# EAGLE design ComputerLED_Display (EAGLE 4.16)
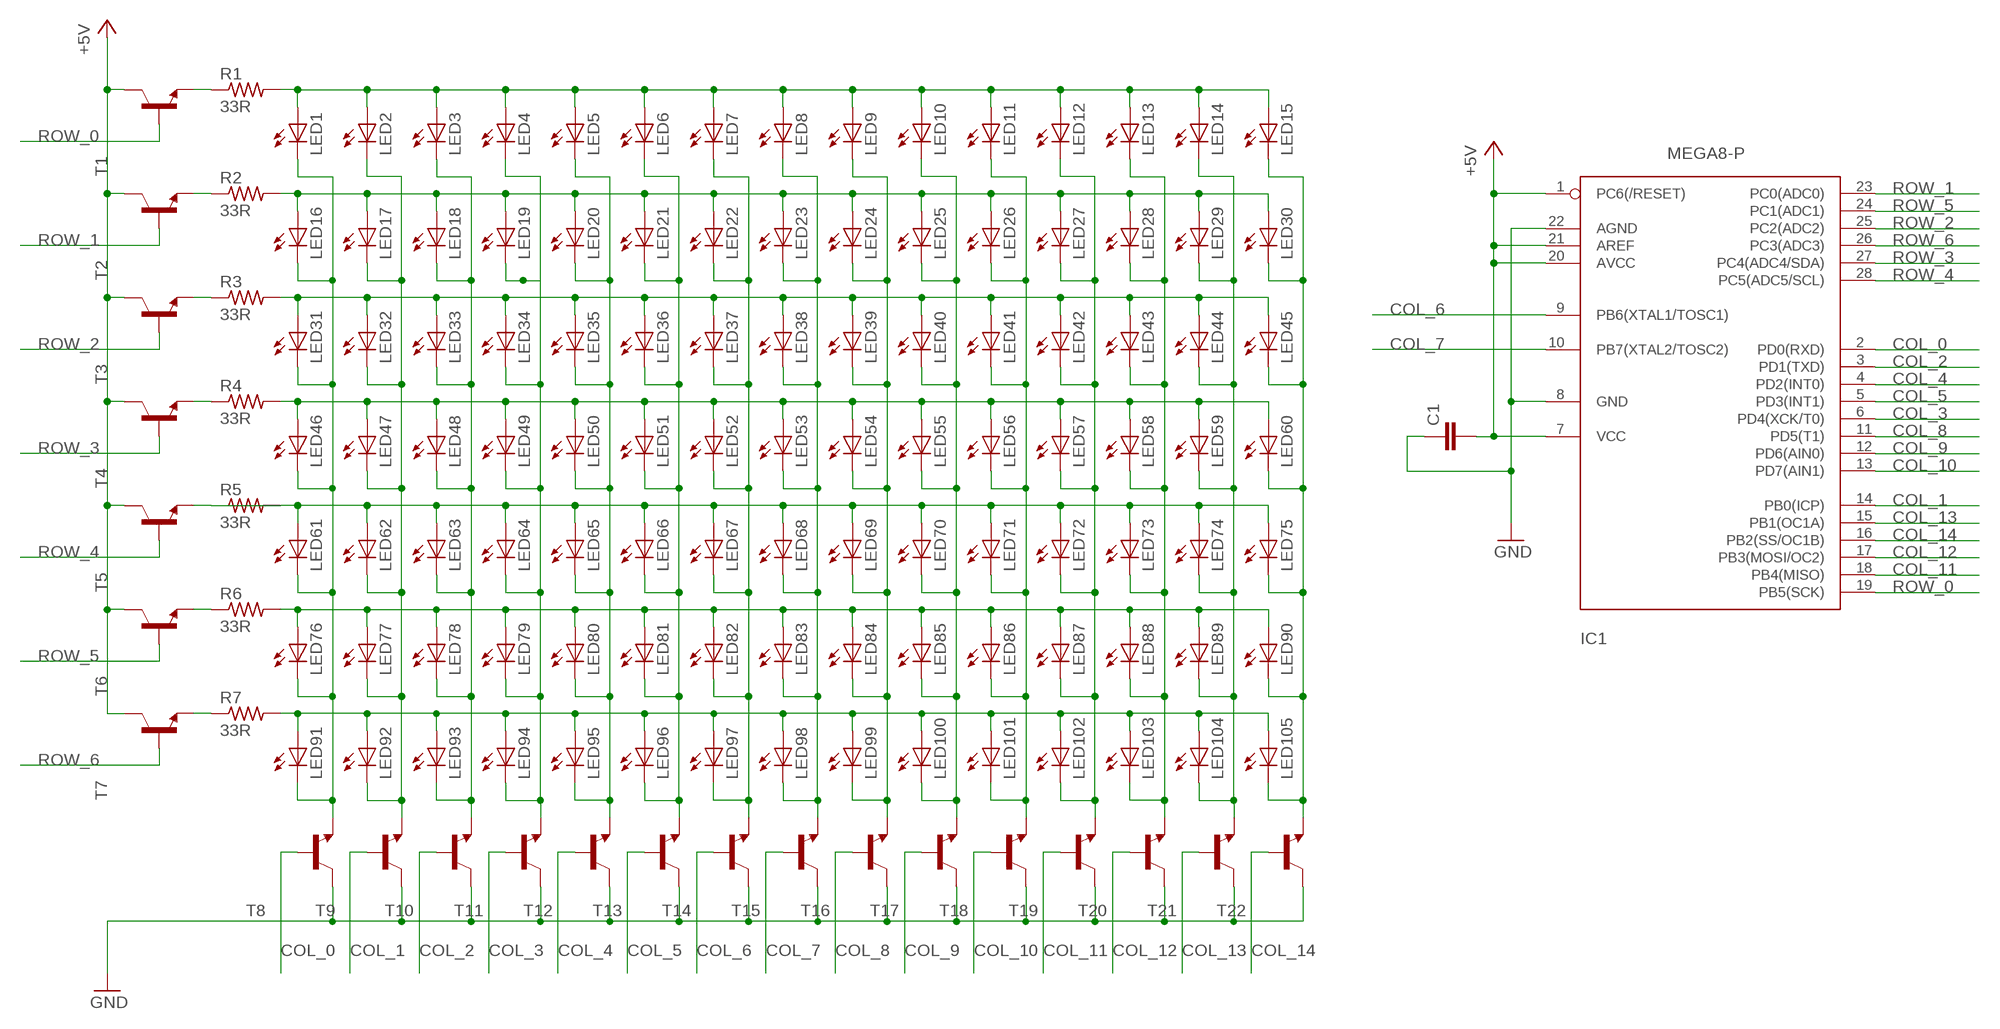
[diagram p0: schematic, sheet 1]

## Parts
C1  C-EU025-024X044  [C025-024X044]
IC1  MEGA8-P  [DIL28-3]
LED1  LED3MM  [LED3MM]
LED2  LED3MM  [LED3MM]
LED3  LED3MM  [LED3MM]
LED4  LED3MM  [LED3MM]
LED5  LED3MM  [LED3MM]
LED6  LED3MM  [LED3MM]
LED7  LED3MM  [LED3MM]
LED8  LED3MM  [LED3MM]
LED9  LED3MM  [LED3MM]
LED10  LED3MM  [LED3MM]
LED11  LED3MM  [LED3MM]
LED12  LED3MM  [LED3MM]
LED13  LED3MM  [LED3MM]
LED14  LED3MM  [LED3MM]
LED15  LED3MM  [LED3MM]
LED16  LED3MM  [LED3MM]
LED17  LED3MM  [LED3MM]
LED18  LED3MM  [LED3MM]
LED19  LED3MM  [LED3MM]
LED20  LED3MM  [LED3MM]
LED21  LED3MM  [LED3MM]
LED22  LED3MM  [LED3MM]
LED23  LED3MM  [LED3MM]
LED24  LED3MM  [LED3MM]
LED25  LED3MM  [LED3MM]
LED26  LED3MM  [LED3MM]
LED27  LED3MM  [LED3MM]
LED28  LED3MM  [LED3MM]
LED29  LED3MM  [LED3MM]
LED30  LED3MM  [LED3MM]
LED31  LED3MM  [LED3MM]
LED32  LED3MM  [LED3MM]
LED33  LED3MM  [LED3MM]
LED34  LED3MM  [LED3MM]
LED35  LED3MM  [LED3MM]
LED36  LED3MM  [LED3MM]
LED37  LED3MM  [LED3MM]
LED38  LED3MM  [LED3MM]
LED39  LED3MM  [LED3MM]
LED40  LED3MM  [LED3MM]
LED41  LED3MM  [LED3MM]
LED42  LED3MM  [LED3MM]
LED43  LED3MM  [LED3MM]
LED44  LED3MM  [LED3MM]
LED45  LED3MM  [LED3MM]
LED46  LED3MM  [LED3MM]
LED47  LED3MM  [LED3MM]
LED48  LED3MM  [LED3MM]
LED49  LED3MM  [LED3MM]
LED50  LED3MM  [LED3MM]
LED51  LED3MM  [LED3MM]
LED52  LED3MM  [LED3MM]
LED53  LED3MM  [LED3MM]
LED54  LED3MM  [LED3MM]
LED55  LED3MM  [LED3MM]
LED56  LED3MM  [LED3MM]
LED57  LED3MM  [LED3MM]
LED58  LED3MM  [LED3MM]
LED59  LED3MM  [LED3MM]
LED60  LED3MM  [LED3MM]
LED61  LED3MM  [LED3MM]
LED62  LED3MM  [LED3MM]
LED63  LED3MM  [LED3MM]
LED64  LED3MM  [LED3MM]
LED65  LED3MM  [LED3MM]
LED66  LED3MM  [LED3MM]
LED67  LED3MM  [LED3MM]
LED68  LED3MM  [LED3MM]
LED69  LED3MM  [LED3MM]
LED70  LED3MM  [LED3MM]
LED71  LED3MM  [LED3MM]
LED72  LED3MM  [LED3MM]
LED73  LED3MM  [LED3MM]
LED74  LED3MM  [LED3MM]
LED75  LED3MM  [LED3MM]
LED76  LED3MM  [LED3MM]
LED77  LED3MM  [LED3MM]
LED78  LED3MM  [LED3MM]
LED79  LED3MM  [LED3MM]
LED80  LED3MM  [LED3MM]
LED81  LED3MM  [LED3MM]
LED82  LED3MM  [LED3MM]
LED83  LED3MM  [LED3MM]
LED84  LED3MM  [LED3MM]
LED85  LED3MM  [LED3MM]
LED86  LED3MM  [LED3MM]
LED87  LED3MM  [LED3MM]
LED88  LED3MM  [LED3MM]
LED89  LED3MM  [LED3MM]
LED90  LED3MM  [LED3MM]
LED91  LED3MM  [LED3MM]
LED92  LED3MM  [LED3MM]
LED93  LED3MM  [LED3MM]
LED94  LED3MM  [LED3MM]
LED95  LED3MM  [LED3MM]
LED96  LED3MM  [LED3MM]
LED97  LED3MM  [LED3MM]
LED98  LED3MM  [LED3MM]
LED99  LED3MM  [LED3MM]
LED100  LED3MM  [LED3MM]
LED101  LED3MM  [LED3MM]
LED102  LED3MM  [LED3MM]
LED103  LED3MM  [LED3MM]
LED104  LED3MM  [LED3MM]
LED105  LED3MM  [LED3MM]
R1  33R  R-US_0204/5  [0204/5]
R2  33R  R-US_0204/5  [0204/5]
R3  33R  R-US_0204/5  [0204/5]
R4  33R  R-US_0204/5  [0204/5]
R5  33R  R-US_0204/5  [0204/5]
R6  33R  R-US_0204/5  [0204/5]
R7  33R  R-US_0204/5  [0204/5]
T1  BC635-NPN-TO92-BCE  [TO92-BCE]
T2  BC635-NPN-TO92-BCE  [TO92-BCE]
T3  BC635-NPN-TO92-BCE  [TO92-BCE]
T4  BC635-NPN-TO92-BCE  [TO92-BCE]
T5  BC635-NPN-TO92-BCE  [TO92-BCE]
T6  BC635-NPN-TO92-BCE  [TO92-BCE]
T7  BC635-NPN-TO92-BCE  [TO92-BCE]
T8  BC635-NPN-TO92-BCE  [TO92-BCE]
T9  BC635-NPN-TO92-BCE  [TO92-BCE]
T10  BC635-NPN-TO92-BCE  [TO92-BCE]
T11  BC635-NPN-TO92-BCE  [TO92-BCE]
T12  BC635-NPN-TO92-BCE  [TO92-BCE]
T13  BC635-NPN-TO92-BCE  [TO92-BCE]
T14  BC635-NPN-TO92-BCE  [TO92-BCE]
T15  BC635-NPN-TO92-BCE  [TO92-BCE]
T16  BC635-NPN-TO92-BCE  [TO92-BCE]
T17  BC635-NPN-TO92-BCE  [TO92-BCE]
T18  BC635-NPN-TO92-BCE  [TO92-BCE]
T19  BC635-NPN-TO92-BCE  [TO92-BCE]
T20  BC635-NPN-TO92-BCE  [TO92-BCE]
T21  BC635-NPN-TO92-BCE  [TO92-BCE]
T22  BC635-NPN-TO92-BCE  [TO92-BCE]

## Nets
+5V: C1.2 IC1.1(PC6(/RESET)) IC1.7(VCC) IC1.20(AVCC) IC1.21(AREF) T1.C T2.C T3.C T4.C T5.C T6.C T7.C
COL_0: IC1.2(PD0(RXD)) T8.B
COL_1: IC1.14(PB0(ICP)) T9.B
COL_2: IC1.3(PD1(TXD)) T10.B
COL_3: IC1.6(PD4(XCK/T0)) T11.B
COL_4: IC1.4(PD2(INT0)) T12.B
COL_5: IC1.5(PD3(INT1)) T13.B
COL_6: IC1.9(PB6(XTAL1/TOSC1)) T14.B
COL_7: IC1.10(PB7(XTAL2/TOSC2)) T15.B
COL_8: IC1.11(PD5(T1)) T16.B
COL_9: IC1.12(PD6(AIN0)) T17.B
COL_10: IC1.13(PD7(AIN1)) T18.B
COL_11: IC1.18(PB4(MISO)) T19.B
COL_12: IC1.17(PB3(MOSI/OC2)) T20.B
COL_13: IC1.15(PB1(OC1A)) T21.B
COL_14: IC1.16(PB2(SS/OC1B)) T22.B
GND: C1.1 IC1.8(GND) IC1.22(AGND) T8.C T9.C T10.C T11.C T12.C T13.C T14.C T15.C T16.C T17.C T18.C T19.C T20.C T21.C T22.C
N$1: LED16.A LED17.A LED18.A LED19.A LED20.A LED21.A LED22.A LED23.A LED24.A LED25.A LED26.A LED27.A LED28.A LED29.A LED30.A R2.2
N$2: LED1.A LED2.A LED3.A LED4.A LED5.A LED6.A LED7.A LED8.A LED9.A LED10.A LED11.A LED12.A LED13.A LED14.A LED15.A R1.2
N$3: LED31.A LED32.A LED33.A LED34.A LED35.A LED36.A LED37.A LED38.A LED39.A LED40.A LED41.A LED42.A LED43.A LED44.A LED45.A R3.2
N$4: LED46.A LED47.A LED48.A LED49.A LED50.A LED51.A LED52.A LED53.A LED54.A LED55.A LED56.A LED57.A LED58.A LED59.A LED60.A R4.2
N$5: LED61.A LED62.A LED63.A LED64.A LED65.A LED66.A LED67.A LED68.A LED69.A LED70.A LED71.A LED72.A LED73.A LED74.A LED75.A R5.2
N$6: LED76.A LED77.A LED78.A LED79.A LED80.A LED81.A LED82.A LED83.A LED84.A LED85.A LED86.A LED87.A LED88.A LED89.A LED90.A R6.2
N$7: LED91.A LED92.A LED93.A LED94.A LED95.A LED96.A LED97.A LED98.A LED99.A LED100.A LED101.A LED102.A LED103.A LED104.A LED105.A R7.2
N$8: LED1.K(C) LED16.K(C) LED31.K(C) LED46.K(C) LED61.K(C) LED76.K(C) LED91.K(C) T8.E
N$9: LED2.K(C) LED17.K(C) LED32.K(C) LED47.K(C) LED62.K(C) LED77.K(C) LED92.K(C) T9.E
N$10: LED3.K(C) LED18.K(C) LED33.K(C) LED48.K(C) LED63.K(C) LED78.K(C) LED93.K(C) T10.E
N$11: LED4.K(C) LED19.K(C) LED34.K(C) LED49.K(C) LED64.K(C) LED79.K(C) LED94.K(C) T11.E
N$12: LED5.K(C) LED20.K(C) LED35.K(C) LED50.K(C) LED65.K(C) LED80.K(C) LED95.K(C) T12.E
N$13: LED6.K(C) LED21.K(C) LED36.K(C) LED51.K(C) LED66.K(C) LED81.K(C) LED96.K(C) T13.E
N$14: LED7.K(C) LED22.K(C) LED37.K(C) LED52.K(C) LED67.K(C) LED82.K(C) LED97.K(C) T14.E
N$15: LED8.K(C) LED23.K(C) LED38.K(C) LED53.K(C) LED68.K(C) LED83.K(C) LED98.K(C) T15.E
N$16: LED9.K(C) LED24.K(C) LED39.K(C) LED54.K(C) LED69.K(C) LED84.K(C) LED99.K(C) T16.E
N$17: LED10.K(C) LED25.K(C) LED40.K(C) LED55.K(C) LED70.K(C) LED85.K(C) LED100.K(C) T17.E
N$18: LED11.K(C) LED26.K(C) LED41.K(C) LED56.K(C) LED71.K(C) LED86.K(C) LED101.K(C) T18.E
N$19: LED12.K(C) LED27.K(C) LED42.K(C) LED57.K(C) LED72.K(C) LED87.K(C) LED102.K(C) T19.E
N$20: LED13.K(C) LED28.K(C) LED43.K(C) LED58.K(C) LED73.K(C) LED88.K(C) LED103.K(C) T20.E
N$21: LED14.K(C) LED29.K(C) LED44.K(C) LED59.K(C) LED74.K(C) LED89.K(C) LED104.K(C) T21.E
N$22: LED15.K(C) LED30.K(C) LED45.K(C) LED60.K(C) LED75.K(C) LED90.K(C) LED105.K(C) T22.E
N$23: R7.1 T7.E
N$24: R6.1 T6.E
N$25: R5.1 T5.E
N$26: R4.1 T4.E
N$27: R3.1 T3.E
N$28: R2.1 T2.E
N$29: R1.1 T1.E
ROW_0: IC1.19(PB5(SCK)) T1.B
ROW_1: IC1.23(PC0(ADC0)) T2.B
ROW_2: IC1.25(PC2(ADC2)) T3.B
ROW_3: IC1.27(PC4(ADC4/SDA)) T4.B
ROW_4: IC1.28(PC5(ADC5/SCL)) T5.B
ROW_5: IC1.24(PC1(ADC1)) T6.B
ROW_6: IC1.26(PC3(ADC3)) T7.B

## Library data of the parts
C1 = rcl:C-EU: CAPACITOR, European symbol
IC1 = atmel:MEGA8-P: MICROCONTROLLER 8 Kbytes FLASH 1 kbytes SRAM 512 bytes EEPROM USART 4-channel 10 bit ADC 2-channel 8 bit ADC Source: avr.lbr
LED1-LED105 = led:LED: LED OSRAM: - CHIPLED LG R971, LG N971, LY N971, LG Q971, LY Q971, LO R971, LY R971 LH N974, LH R974 LS Q976, LO Q976, LY Q976 LO Q996 - Hyper CHIPLED LW Q18S LB Q993, LB Q99A, LB R99A - SideLED LS A670, LO A670, LY A670, LG A670, LP A670 LB A673, LV A673, LT A673, LW A673 LH A674 LY A675 LS A676, LA A676, LO A676, LY A676, LW A676 LS A679, LY A679, LG A679 - Hyper Micro SIDELED® LS Y876, LA Y876, LO Y876, LY Y876 LT Y87S - SmartLED LW L88C, LW L88S LB L89C, LB L89S, LG L890 LS L89K, LO L89K, LY L89K LS L896, LA L896, LO L896, LY L896 - TOPLED LS T670, LO T670, LY T670, LG T670, LP T670 LSG T670, LSP T670, LSY T670, LOP T670, LYG T670 LG T671, LOG T671, LSG T671 LB T673, LV T673, LT T673, LW T673 LH T674 LS T676, LA T676, LO T676, LY T676, LB T676, LH T676, LSB T676, LW T676 LB T67C, LV T67C, LT T67C, LS T67K, LO T67K, LY T67K, LW E67C LS E67B, LA E67B, LO E67B, LY E67B, LB E67C, LV E67C, LT E67C LW T67C LS T679, LY T679, LG T679 LS T770, LO T770, LY T770, LG T770, LP T770 LB T773, LV T773, LT T773, LW T773 LH T774 LS E675, LA E675, LY E675, LS T675 LS T776, LA T776, LO T776, LY T776, LB T776 LHGB T686 LT T68C, LB T68C - Hyper Mini TOPLED® LB M676 - Mini TOPLED Santana® LG M470 LS M47K, LO M47K, LY M47K Source: http://www.osram.convergy.de - LUMILED® LXK2-PW12-R00, LXK2-PW12-S00, LXK2-PW14-U00, LXK2-PW14-V00 LXK2-PM12-R00, LXK2-PM12-S00, LXK2-PM14-U00 LXK2-PE12-Q00, LXK2-PE12-R00, LXK2-PE12-S00, LXK2-PE14-T00, LXK2-PE14-U00 LXK2-PB12-K00, LXK2-PB12-L00, LXK2-PB12-M00, LXK2-PB14-N00, LXK2-PB14-P00, LXK2-PB14-Q00 LXK2-PR12-L00, LXK2-PR12-M00, LXK2-PR14-Q00, LXK2-PR14-R00 LXK2-PD12-Q00, LXK2-PD12-R00, LXK2-PD12-S00 LXK2-PH12-R00, LXK2-PH12-S00 LXK2-PL12-P00, LXK2-PL12-Q00, LXK2-PL12-R00 Source: www.luxeon.com
R1-R7 = rcl:R-US_: RESISTOR, American symbol
T1-T22 = transistor:*-NPN-: NPN Transistror

## Board
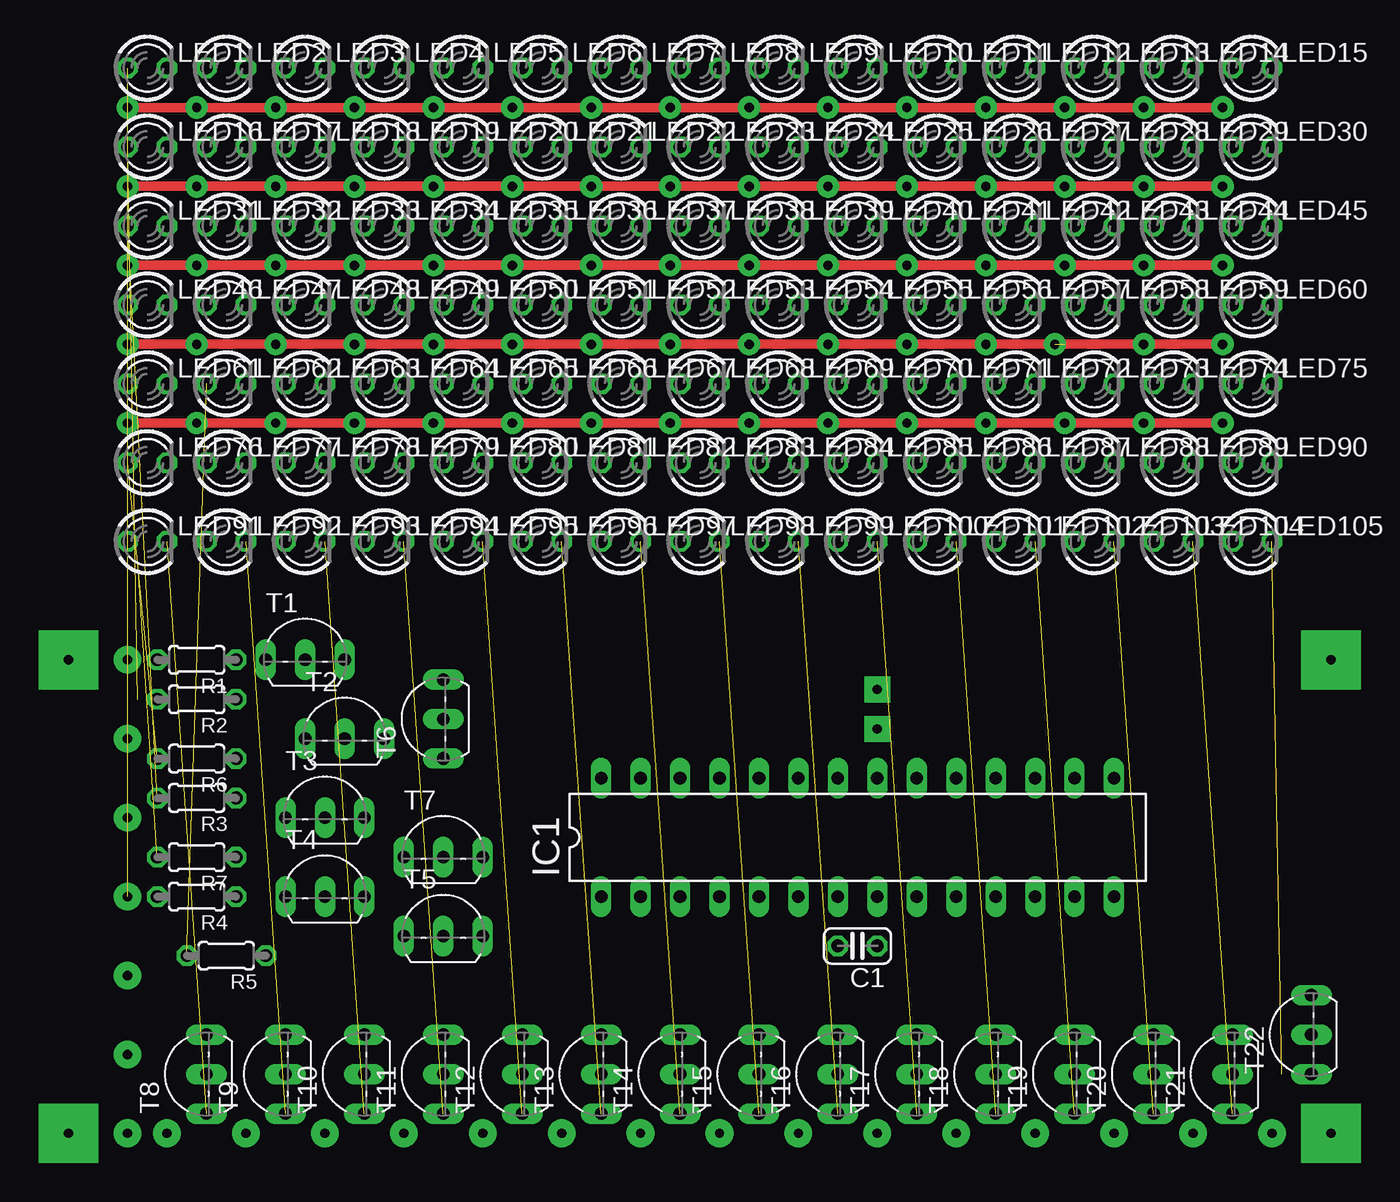
[diagram p1: board, top side]
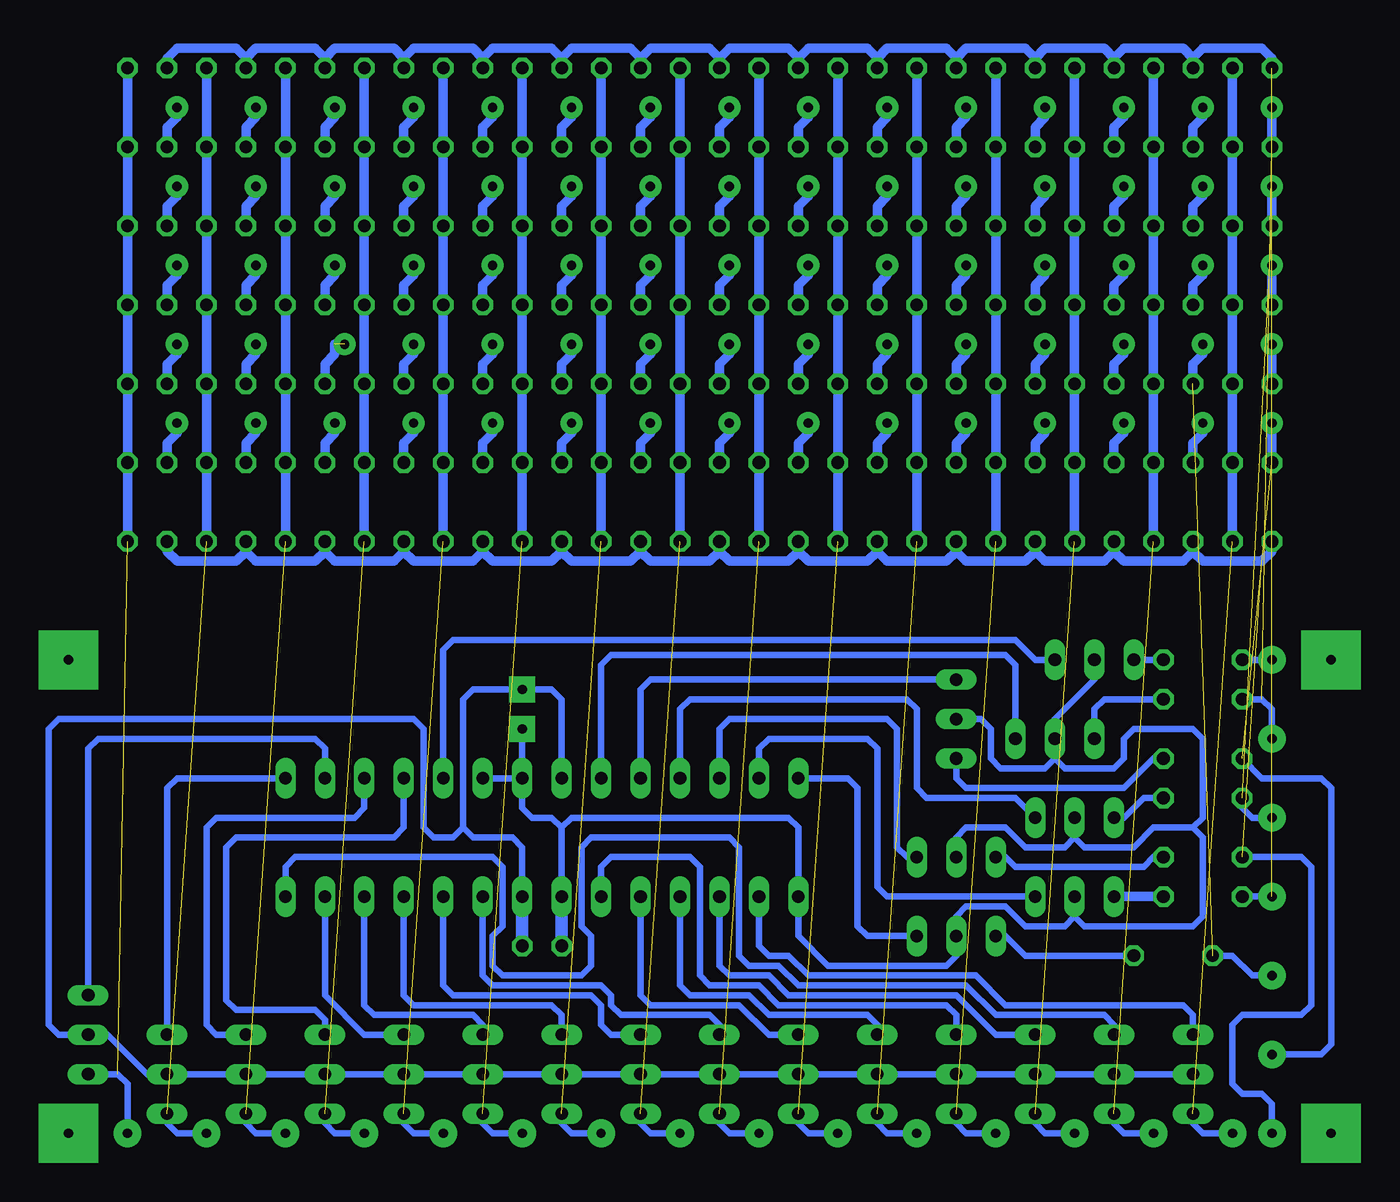
[diagram p2: board, bottom side, seen from below]

No outline drawn. Coordinates in mm, seen from the top.
Copper layers (1*16): Top 0.035mm / dielectric 1.5mm / Bottom 0.035mm
Design rules "default": minimum track width 10mil, minimum drill 24mil, track to track 8mil, track to pad 8mil, pad to pad 8mil, via to via 8mil, smd to smd 8mil, copper to edge 40mil, drill to drill 8mil, minimum pad ring 10mil, minimum via ring 8mil, stop-mask expansion 4mil, vias tented up to drill 0mil, thermal gap 10mil
tKeepout: 8 lines

### Footprints (pad centres in the part's own frame; a part is rotated, then mirrored left to right if it is on the bottom)
C025-024X044 = drill 0.813 octagon: 1 -1.27,0; 2 1.27,0
DIL28-3 = drill 0.813 long: 1 -16.51,-3.81; 2 -13.97,-3.81; 3 -11.43,-3.81; 4 -8.89,-3.81; 5 -6.35,-3.81; 6 -3.81,-3.81; 7 -1.27,-3.81; 8 1.27,-3.81; 9 3.81,-3.81; 10 6.35,-3.81; 11 8.89,-3.81; 12 11.43,-3.81; 13 13.97,-3.81; 14 16.51,-3.81; 15 16.51,3.81; 16 13.97,3.81; 17 11.43,3.81; 18 8.89,3.81; 19 6.35,3.81; 20 3.81,3.81; 21 1.27,3.81; 22 -1.27,3.81; 23 -3.81,3.81; 24 -6.35,3.81; 25 -8.89,3.81; 26 -11.43,3.81; 27 -13.97,3.81; 28 -16.51,3.81
LED3MM = drill 0.813 octagon: A -1.27,0; K 1.27,0
0204/5 = drill 0.813 octagon: 1 -2.54,0; 2 2.54,0
TO92-BCE = drill 0.813 long: B 2.54,0; C 0,0; E -2.54,0

### Placement (x,y rotation side)
C1  53.34,-0.64 180 top
IC1  53.34,6.35 0 top
LED1  7.62,55.88 0 top
LED2  12.7,55.88 0 top
LED3  17.78,55.88 0 top
LED4  22.86,55.88 0 top
LED5  27.94,55.88 0 top
LED6  33.02,55.88 0 top
LED7  38.1,55.88 0 top
LED8  43.18,55.88 0 top
LED9  48.26,55.88 0 top
LED10  53.34,55.88 0 top
LED11  58.42,55.88 0 top
LED12  63.5,55.88 0 top
LED13  68.58,55.88 0 top
LED14  73.66,55.88 0 top
LED15  78.74,55.88 0 top
LED16  7.62,50.8 0 top
LED17  12.7,50.8 0 top
LED18  17.78,50.8 0 top
LED19  22.86,50.8 0 top
LED20  27.94,50.8 0 top
LED21  33.02,50.8 0 top
LED22  38.1,50.8 0 top
LED23  43.18,50.8 0 top
LED24  48.26,50.8 0 top
LED25  53.34,50.8 0 top
LED26  58.42,50.8 0 top
LED27  63.5,50.8 0 top
LED28  68.58,50.8 0 top
LED29  73.66,50.8 0 top
LED30  78.74,50.8 0 top
LED31  7.62,45.72 0 top
LED32  12.7,45.72 0 top
LED33  17.78,45.72 0 top
LED34  22.86,45.72 0 top
LED35  27.94,45.72 0 top
LED36  33.02,45.72 0 top
LED37  38.1,45.72 0 top
LED38  43.18,45.72 0 top
LED39  48.26,45.72 0 top
LED40  53.34,45.72 0 top
LED41  58.42,45.72 0 top
LED42  63.5,45.72 0 top
LED43  68.58,45.72 0 top
LED44  73.66,45.72 0 top
LED45  78.74,45.72 0 top
LED46  7.62,40.64 0 top
LED47  12.7,40.64 0 top
LED48  17.78,40.64 0 top
LED49  22.86,40.64 0 top
LED50  27.94,40.64 0 top
LED51  33.02,40.64 0 top
LED52  38.1,40.64 0 top
LED53  43.18,40.64 0 top
LED54  48.26,40.64 0 top
LED55  53.34,40.64 0 top
LED56  58.42,40.64 0 top
LED57  63.5,40.64 0 top
LED58  68.58,40.64 0 top
LED59  73.66,40.64 0 top
LED60  78.74,40.64 0 top
LED61  7.62,35.56 0 top
LED62  12.7,35.56 0 top
LED63  17.78,35.56 0 top
LED64  22.86,35.56 0 top
LED65  27.94,35.56 0 top
LED66  33.02,35.56 0 top
LED67  38.1,35.56 0 top
LED68  43.18,35.56 0 top
LED69  48.26,35.56 0 top
LED70  53.34,35.56 0 top
LED71  58.42,35.56 0 top
LED72  63.5,35.56 0 top
LED73  68.58,35.56 0 top
LED74  73.66,35.56 0 top
LED75  78.74,35.56 0 top
LED76  7.62,30.48 0 top
LED77  12.7,30.48 0 top
LED78  17.78,30.48 0 top
LED79  22.86,30.48 0 top
LED80  27.94,30.48 0 top
LED81  33.02,30.48 0 top
LED82  38.1,30.48 0 top
LED83  43.18,30.48 0 top
LED84  48.26,30.48 0 top
LED85  53.34,30.48 0 top
LED86  58.42,30.48 0 top
LED87  63.5,30.48 0 top
LED88  68.58,30.48 0 top
LED89  73.66,30.48 0 top
LED90  78.74,30.48 0 top
LED91  7.62,25.4 0 top
LED92  12.7,25.4 0 top
LED93  17.78,25.4 0 top
LED94  22.86,25.4 0 top
LED95  27.94,25.4 0 top
LED96  33.02,25.4 0 top
LED97  38.1,25.4 0 top
LED98  43.18,25.4 0 top
LED99  48.26,25.4 0 top
LED100  53.34,25.4 0 top
LED101  58.42,25.4 0 top
LED102  63.5,25.4 0 top
LED103  68.58,25.4 0 top
LED104  73.66,25.4 0 top
LED105  78.74,25.4 0 top
R1  10.79,17.78 180 top
R2  10.79,15.24 180 top
R3  10.79,8.89 180 top
R4  10.79,2.54 180 top
R5  12.7,-1.27 180 top
R6  10.79,11.43 180 top
R7  10.79,5.08 180 top
T1  17.78,17.78 0 top
T2  20.32,12.7 0 top
T3  19.05,7.62 0 top
T4  19.05,2.54 0 top
T5  26.67,0 0 top
T6  26.67,13.97 90 top
T7  26.67,5.08 0 top
T8  11.43,-8.89 90 top
T9  16.51,-8.89 90 top
T10  21.59,-8.89 90 top
T11  26.67,-8.89 90 top
T12  31.75,-8.89 90 top
T13  36.83,-8.89 90 top
T14  41.91,-8.89 90 top
T15  46.99,-8.89 90 top
T16  52.07,-8.89 90 top
T17  57.15,-8.89 90 top
T18  62.23,-8.89 90 top
T19  67.31,-8.89 90 top
T20  72.39,-8.89 90 top
T21  77.47,-8.89 90 top
T22  82.55,-6.35 90 top

### Tracks (layer width: path | path; a pad name or v marks a point on that pad's centre or on a via)
+5V  (via drill 0.6 pad 1.68)
  Bottom 0.406: T1.C 17.78,16.51 20.32,13.97 T2.C 20.32,11.43 | 20.32,11.43 19.68,10.79 16.51,10.79 15.88,11.43 15.88,12.7 15.24,13.34 11.43,13.34 10.79,12.7 10.79,7.62 11.43,6.99 | 11.43,6.99 13.97,6.99 15.24,5.71 18.41,5.71 19.05,6.35 | 19.05,6.35 T3.C | 19.05,6.35 19.68,5.71 22.23,5.71 23.5,6.99 26.04,6.99 26.67,6.35 T7.C | 20.32,11.43 20.95,10.79 23.81,10.79 24.45,11.43 24.45,13.34 25.08,13.97 T6.C | 11.43,6.99 10.79,6.35 10.79,1.27 11.43,0.64 18.41,0.64 19.05,1.27 | 19.05,1.27 19.68,0.64 22.23,0.64 23.5,1.91 26.04,1.91 26.67,1.27 T5.C 26.67,-1.27 27.3,-1.91 34.92,-1.91 36.83,0 IC1.1 36.83,6.99 37.47,7.62 51.44,7.62 52.07,6.99 | 19.05,1.27 T4.C | 52.07,6.99 IC1.7 | IC1.21 54.61,8.26 53.98,7.62 52.7,7.62 52.07,6.99 | IC1.21 v54.61,13.34 | IC1.21 IC1.20
  Bottom 0.813: IC1.7 C1.2
COL_0
  Bottom 0.406: IC1.2 39.37,-0.64 38.73,-1.27 37.47,-1.27 36.2,-2.54 25.4,-2.54 23.5,-4.45 12.06,-4.45 11.43,-5.08 T8.B
COL_1
  Bottom 0.406: IC1.14 69.85,4.45 69.22,5.08 56.52,5.08 55.88,4.45 55.88,0.64 56.52,0 56.52,-1.91 55.88,-2.54 50.8,-2.54 50.16,-1.91 50.16,0 50.8,0.64 50.8,5.71 50.16,6.35 41.27,6.35 40.64,5.71 40.64,-1.27 40.01,-1.91 38.1,-1.91 36.83,-3.17 26.04,-3.17 24.13,-5.08 17.14,-5.08 16.51,-5.71 T9.B
COL_2
  Bottom 0.406: IC1.3 41.91,-1.91 41.27,-2.54 38.73,-2.54 37.47,-3.81 26.67,-3.81 24.13,-6.35 T10.B
COL_3
  Bottom 0.406: IC1.6 49.53,4.45 48.9,5.08 43.81,5.08 43.18,4.45 43.18,-2.54 42.55,-3.17 39.37,-3.17 38.1,-4.45 27.3,-4.45 26.67,-5.08 T11.B
COL_4
  Bottom 0.406: IC1.4 44.45,-3.17 43.81,-3.81 40.01,-3.81 38.73,-5.08 32.38,-5.08 31.75,-5.71 T12.B
COL_5
  Bottom 0.406: IC1.5 46.99,-3.81 46.35,-4.45 40.64,-4.45 38.73,-6.35 T13.B
COL_6
  Bottom 0.406: IC1.9 57.15,-2.54 56.52,-3.17 49.53,-3.17 48.9,-3.81 48.9,-4.45 48.26,-5.08 42.55,-5.08 41.91,-5.71 T14.B
COL_7
  Bottom 0.406: IC1.10 59.69,-3.17 59.05,-3.81 50.16,-3.81 49.53,-4.45 49.53,-5.71 48.9,-6.35 T15.B
COL_8
  Bottom 0.406: IC1.11 62.23,-3.81 61.59,-4.45 52.7,-4.45 52.07,-5.08 T16.B
COL_9
  Bottom 0.406: IC1.12 64.77,-4.45 64.14,-5.08 57.78,-5.08 57.15,-5.71 T17.B
COL_10
  Bottom 0.406: IC1.13 67.31,-3.81 64.77,-6.35 T18.B
COL_11
  Bottom 0.406: IC1.18 62.23,6.99 62.87,6.35 73.03,6.35 73.66,5.71 73.66,-4.13 73.03,-4.76 67.94,-4.76 67.31,-5.4 T19.B
COL_12
  Bottom 0.406: IC1.17 64.77,8.26 65.41,7.62 74.3,7.62 74.93,6.99 74.93,-5.71 74.3,-6.35 T20.B
COL_13
  Bottom 0.406: IC1.15 76.83,10.16 77.47,9.53 T21.B
COL_14
  Bottom 0.406: IC1.16 67.31,12.06 67.94,12.7 81.92,12.7 82.55,12.06 T22.B
GND  (via drill 0.6 pad 1.68)
  Bottom 0.406: T8.C T9.C T10.C T11.C T12.C T13.C T14.C T15.C T16.C T17.C T18.C T19.C T20.C T21.C 78.74,-8.89 81.28,-6.35 T22.C 84.45,-6.35 85.09,-5.71 85.09,13.34 84.45,13.97 61.59,13.97 60.96,13.34 60.96,6.99 60.33,6.35 59.05,6.35 58.42,6.99 | IC1.8 54.61,5.71 55.24,6.35 57.78,6.35 58.42,6.99 | IC1.22 52.07,15.24 52.7,15.88 v54.61,15.88 57.78,15.88 58.42,15.24 58.42,6.99
  Bottom 0.813: IC1.8 C1.1
N$1  (via drill 0.6 pad 1.42)  (1 unrouted)
  Top 0.61: v6.35,53.34 v10.79,53.34 v15.88,53.34 v20.95,53.34 v26.04,53.34 v31.11,53.34 v36.2,53.34 v41.27,53.34 v46.35,53.34 v51.44,53.34 v56.52,53.34 v61.59,53.34 v66.67,53.34 v71.75,53.34 v76.83,53.34
  Bottom 0.406: R2.2 6.99,15.24 6.35,14.61 6.35,12.7
  Bottom 0.61: LED16.A v6.35,53.34 | v10.79,53.34 10.79,52.7 11.43,52.07 LED17.A | LED18.A 16.51,52.07 15.88,52.7 v15.88,53.34 | LED19.A 21.59,52.07 20.95,52.7 v20.95,53.34 | LED20.A 26.67,52.07 26.04,52.7 v26.04,53.34 | LED21.A 31.75,52.07 31.11,52.7 v31.11,53.34 | LED22.A 36.83,52.07 36.2,52.7 v36.2,53.34 | LED23.A 41.91,52.07 41.27,52.7 v41.27,53.34 | LED24.A 46.99,52.07 46.35,52.7 v46.35,53.34 | LED25.A 52.07,52.07 51.44,52.7 v51.44,53.34 | LED26.A 57.15,52.07 56.52,52.7 v56.52,53.34 | LED27.A 62.23,52.07 61.59,52.7 v61.59,53.34 | LED28.A 67.31,52.07 66.67,52.7 v66.67,53.34 | LED29.A 72.39,52.07 71.75,52.7 v71.75,53.34 | LED30.A 77.47,52.07 76.83,52.7 v76.83,53.34
N$2  (1 unrouted)
  Bottom 0.406: 6.35,17.78 R1.2
  Bottom 0.61: LED1.A 6.35,56.52 6.99,57.15 10.79,57.15 11.43,56.52 | 11.43,56.52 12.06,57.15 15.88,57.15 16.51,56.52 | 16.51,56.52 17.14,57.15 20.95,57.15 21.59,56.52 | 21.59,56.52 22.23,57.15 26.04,57.15 26.67,56.52 | 26.67,56.52 27.3,57.15 31.11,57.15 31.75,56.52 | 31.75,56.52 32.38,57.15 36.2,57.15 36.83,56.52 | 36.83,56.52 37.47,57.15 41.27,57.15 41.91,56.52 | 41.91,56.52 42.55,57.15 46.35,57.15 46.99,56.52 | 46.99,56.52 47.62,57.15 51.44,57.15 52.07,56.52 | 52.07,56.52 52.7,57.15 56.52,57.15 57.15,56.52 | 57.15,56.52 57.78,57.15 61.59,57.15 62.23,56.52 | 62.23,56.52 62.87,57.15 66.67,57.15 67.31,56.52 | 67.31,56.52 67.94,57.15 71.75,57.15 72.39,56.52 | 72.39,56.52 73.03,57.15 76.83,57.15 77.47,56.52 LED15.A | 72.39,56.52 LED14.A | 67.31,56.52 LED13.A | 62.23,56.52 LED12.A | 57.15,56.52 LED11.A | 52.07,56.52 LED10.A | 46.99,56.52 LED9.A | 41.91,56.52 LED8.A | 36.83,56.52 LED7.A | 31.75,56.52 LED6.A | 26.67,56.52 LED5.A | 21.59,56.52 LED4.A | 16.51,56.52 LED3.A | 11.43,56.52 LED2.A
N$3  (via drill 0.6 pad 1.42)  (1 unrouted)
  Top 0.61: v6.35,48.26 v10.79,48.26 v15.88,48.26 v20.95,48.26 v26.04,48.26 v31.11,48.26 v36.2,48.26 v41.27,48.26 v46.35,48.26 v51.44,48.26 v56.52,48.26 v61.59,48.26 v66.67,48.26 v71.75,48.26 v76.83,48.26
  Bottom 0.406: R3.2 8.26,8.26 7.62,7.62 6.35,7.62
  Bottom 0.61: LED45.A 77.47,46.99 76.83,47.62 v76.83,48.26 | LED31.A v6.35,48.26 | LED32.A 11.43,46.99 10.79,47.62 v10.79,48.26 | LED33.A 16.51,46.99 15.88,47.62 v15.88,48.26 | LED34.A 21.59,46.99 20.95,47.62 v20.95,48.26 | LED35.A 26.67,46.99 26.04,47.62 v26.04,48.26 | LED36.A 31.75,46.99 31.11,47.62 v31.11,48.26 | LED37.A 36.83,46.99 36.2,47.62 v36.2,48.26 | LED38.A 41.91,46.99 41.27,47.62 v41.27,48.26 | LED39.A 46.99,46.99 46.35,47.62 v46.35,48.26 | LED40.A 52.07,46.99 51.44,47.62 v51.44,48.26 | LED41.A 57.15,46.99 56.52,47.62 v56.52,48.26 | LED42.A 62.23,46.99 61.59,47.62 v61.59,48.26 | LED43.A 67.31,46.99 66.67,47.62 v66.67,48.26 | LED44.A 72.39,46.99 71.75,47.62 v71.75,48.26
N$4  (via drill 0.6 pad 1.42)  (1 unrouted)
  Top 0.61: v6.35,43.18 v10.79,43.18 v15.88,43.18 v20.95,43.18 v26.04,43.18 v31.11,43.18 v36.2,43.18 v41.27,43.18 v46.35,43.18 v51.44,43.18 v56.52,43.18 v61.59,43.18 v66.67,43.18 v71.75,43.18 v76.83,43.18
  Bottom 0.406: 6.35,2.54 R4.2
  Bottom 0.61: LED46.A v6.35,43.18 | v76.83,43.18 76.83,42.55 77.47,41.91 LED60.A | LED59.A 72.39,41.91 71.75,42.55 v71.75,43.18 | LED58.A 67.31,41.91 66.67,42.55 v66.67,43.18 | LED57.A 62.23,41.91 61.59,42.55 v61.59,43.18 | LED56.A 57.15,41.91 56.52,42.55 v56.52,43.18 | LED55.A 52.07,41.91 51.44,42.55 v51.44,43.18 | LED54.A 46.99,41.91 46.35,42.55 v46.35,43.18 | LED53.A 41.91,41.91 41.27,42.55 v41.27,43.18 | LED52.A 36.83,41.91 36.2,42.55 v36.2,43.18 | LED51.A 31.75,41.91 31.11,42.55 v31.11,43.18 | LED50.A 26.67,41.91 26.04,42.55 v26.04,43.18 | LED49.A 21.59,41.91 20.95,42.55 v20.95,43.18 | LED47.A 11.43,41.91 10.79,42.55 v10.79,43.18 | LED48.A 16.51,41.91 15.88,42.55 v15.88,43.18
N$5  (via drill 0.6 pad 1.42)  (2 unrouted)
  Top 0.61: v6.35,38.1 v10.79,38.1 v15.88,38.1 v20.95,38.1 v26.04,38.1 v31.11,38.1 v36.2,38.1 v41.27,38.1 v46.35,38.1 v51.44,38.1 v56.52,38.1 v61.59,38.1 v66.04,38.1 v71.75,38.1 v76.83,38.1
  Bottom 0.406: R5.2 8.89,-1.27 7.62,-2.54 6.35,-2.54
  Bottom 0.61: LED61.A v6.35,38.1 | v76.83,38.1 76.83,37.47 77.47,36.83 LED75.A | LED74.A 72.39,36.83 71.75,37.47 v71.75,38.1 | LED73.A 67.31,36.83 66.67,37.47 66.67,38.1 | LED72.A 62.23,36.83 61.59,37.47 v61.59,38.1 | LED71.A 57.15,36.83 56.52,37.47 v56.52,38.1 | LED70.A 52.07,36.83 51.44,37.47 v51.44,38.1 | LED69.A 46.99,36.83 46.35,37.47 v46.35,38.1 | LED68.A 41.91,36.83 41.27,37.47 v41.27,38.1 | LED67.A 36.83,36.83 36.2,37.47 v36.2,38.1 | LED66.A 31.75,36.83 31.11,37.47 v31.11,38.1 | LED65.A 26.67,36.83 26.04,37.47 v26.04,38.1 | LED64.A 21.59,36.83 20.95,37.47 v20.95,38.1 | LED63.A 16.51,36.83 15.88,37.47 v15.88,38.1 | LED62.A 11.43,36.83 10.79,37.47 v10.79,38.1
N$6  (via drill 0.6 pad 1.42)  (1 unrouted)
  Top 0.61: v6.35,33.02 v10.79,33.02 v15.88,33.02 v20.95,33.02 v26.04,33.02 v31.11,33.02 v36.2,33.02 v41.27,33.02 v46.35,33.02 v51.44,33.02 v56.52,33.02 v61.59,33.02 v66.67,33.02 v71.75,33.02 v76.83,33.02
  Bottom 0.406: R6.2 6.99,10.16 3.17,10.16 2.54,9.53 2.54,-6.99 3.17,-7.62 6.35,-7.62
  Bottom 0.61: LED76.A v6.35,33.02 | v76.83,33.02 76.83,32.38 77.47,31.75 LED90.A | LED89.A 72.39,31.75 71.75,32.38 v71.75,33.02 | LED88.A 67.31,31.75 66.67,32.38 v66.67,33.02 | LED87.A 62.23,31.75 61.59,32.38 v61.59,33.02 | LED86.A 57.15,31.75 56.52,32.38 v56.52,33.02 | LED85.A 52.07,31.75 51.44,32.38 v51.44,33.02 | LED84.A 46.99,31.75 46.35,32.38 v46.35,33.02 | LED83.A 41.91,31.75 41.27,32.38 v41.27,33.02 | LED82.A 36.83,31.75 36.2,32.38 v36.2,33.02 | LED81.A 31.75,31.75 31.11,32.38 v31.11,33.02 | LED80.A 26.67,31.75 26.04,32.38 v26.04,33.02 | LED79.A 21.59,31.75 20.95,32.38 v20.95,33.02 | LED78.A 16.51,31.75 15.88,32.38 v15.88,33.02 | LED77.A 11.43,31.75 10.79,32.38 v10.79,33.02
N$7  (1 unrouted)
  Bottom 0.406: R7.2 4.45,5.08 3.81,4.45 3.81,-4.45 4.45,-5.08 8.26,-5.08 8.89,-5.71 8.89,-9.53 8.26,-10.16 6.99,-10.16 6.35,-10.79 6.35,-12.7
  Bottom 0.61: LED91.A 6.35,24.77 6.99,24.13 10.79,24.13 11.43,24.77 | 11.43,24.77 12.06,24.13 15.88,24.13 16.51,24.77 | 16.51,24.77 17.14,24.13 20.95,24.13 21.59,24.77 | 21.59,24.77 22.23,24.13 26.04,24.13 26.67,24.77 | 26.67,24.77 27.3,24.13 31.11,24.13 31.75,24.77 | 31.75,24.77 32.38,24.13 36.2,24.13 36.83,24.77 | 36.83,24.77 37.47,24.13 41.27,24.13 41.91,24.77 | 41.91,24.77 42.55,24.13 46.35,24.13 46.99,24.77 | 46.99,24.77 47.62,24.13 51.44,24.13 52.07,24.77 | 52.07,24.77 52.7,24.13 56.52,24.13 57.15,24.77 | 57.15,24.77 57.78,24.13 61.59,24.13 62.23,24.77 | 62.23,24.77 62.87,24.13 66.67,24.13 67.31,24.77 | 67.31,24.77 67.94,24.13 71.75,24.13 72.39,24.77 | 72.39,24.77 73.03,24.13 76.83,24.13 77.47,24.77 LED105.A | 72.39,24.77 LED104.A | 67.31,24.77 LED103.A | 62.23,24.77 LED102.A | 57.15,24.77 LED101.A | 52.07,24.77 LED100.A | 46.99,24.77 LED99.A | 41.91,24.77 LED98.A | 36.83,24.77 LED97.A | 31.75,24.77 LED96.A | 26.67,24.77 LED95.A | 21.59,24.77 LED94.A | 16.51,24.77 LED93.A | 11.43,24.77 LED92.A
N$8  (1 unrouted)
  Bottom 0.406: T8.E 11.43,-12.06 10.79,-12.7 8.89,-12.7
  Bottom 0.61: LED1.K LED16.K LED31.K LED46.K LED61.K LED76.K LED91.K
N$9  (1 unrouted)
  Bottom 0.406: T9.E 16.51,-12.06 15.88,-12.7 13.97,-12.7
  Bottom 0.61: LED2.K LED17.K LED32.K LED47.K LED62.K LED77.K LED92.K
N$10  (1 unrouted)
  Bottom 0.406: T10.E 21.59,-12.06 20.95,-12.7 19.05,-12.7
  Bottom 0.61: LED3.K LED18.K LED33.K LED48.K LED63.K LED78.K LED93.K
N$11  (1 unrouted)
  Bottom 0.406: T11.E 26.67,-12.06 26.04,-12.7 24.13,-12.7
  Bottom 0.61: LED4.K LED19.K LED34.K LED49.K LED64.K LED79.K LED94.K
N$12  (1 unrouted)
  Bottom 0.406: T12.E 31.75,-12.06 31.11,-12.7 29.21,-12.7
  Bottom 0.61: LED5.K LED20.K LED35.K LED50.K LED65.K LED80.K LED95.K
N$13  (1 unrouted)
  Bottom 0.406: T13.E 36.83,-12.06 36.2,-12.7 34.29,-12.7
  Bottom 0.61: LED6.K LED21.K LED36.K LED51.K LED66.K LED81.K LED96.K
N$14  (1 unrouted)
  Bottom 0.406: T14.E 41.91,-12.06 41.27,-12.7 39.37,-12.7
  Bottom 0.61: LED7.K LED22.K LED37.K LED52.K LED67.K LED82.K LED97.K
N$15  (1 unrouted)
  Bottom 0.406: T15.E 46.99,-12.06 46.35,-12.7 44.45,-12.7
  Bottom 0.61: LED8.K LED23.K LED38.K LED53.K LED68.K LED83.K LED98.K
N$16  (1 unrouted)
  Bottom 0.406: T16.E 52.07,-12.06 51.44,-12.7 49.53,-12.7
  Bottom 0.61: LED9.K LED24.K LED39.K LED54.K LED69.K LED84.K LED99.K
N$17  (1 unrouted)
  Bottom 0.406: T17.E 57.15,-12.06 56.52,-12.7 54.61,-12.7
  Bottom 0.61: LED100.K LED85.K LED70.K LED55.K LED40.K LED25.K LED10.K
N$18  (1 unrouted)
  Bottom 0.406: T18.E 62.23,-12.06 61.59,-12.7 59.69,-12.7
  Bottom 0.61: LED101.K LED86.K LED71.K LED56.K LED41.K LED26.K LED11.K
N$19  (1 unrouted)
  Bottom 0.406: T19.E 67.31,-12.06 66.67,-12.7 64.77,-12.7
  Bottom 0.61: LED102.K LED87.K LED72.K LED57.K LED42.K LED27.K LED12.K
N$20  (1 unrouted)
  Bottom 0.406: T20.E 72.39,-12.06 71.75,-12.7 69.85,-12.7
  Bottom 0.61: LED103.K LED88.K LED73.K LED58.K LED43.K LED28.K LED13.K
N$21  (1 unrouted)
  Bottom 0.406: T21.E 77.47,-12.06 76.83,-12.7 74.93,-12.7
  Bottom 0.61: LED104.K LED89.K LED74.K LED59.K LED44.K LED29.K LED14.K
N$22  (1 unrouted)
  Bottom 0.406: T22.E 80.64,-8.89 80.01,-9.53 80.01,-12.7
  Bottom 0.61: LED105.K LED90.K LED75.K LED60.K LED45.K LED30.K LED15.K
N$23
  Bottom 0.406: T7.E 23.5,5.08 22.86,4.45 14.61,4.45 13.97,5.08 R7.1
N$24
  Bottom 0.406: T6.E 26.67,10.16 26.04,9.53 15.88,9.53 13.97,11.43 R6.1
N$25
  Bottom 0.406: T5.E 23.5,0 22.23,-1.27 R5.1
N$26
  Bottom 0.61: R4.1 T4.E
N$27
  Bottom 0.406: T3.E 15.88,7.62 14.61,8.89 R3.1
N$28
  Bottom 0.406: T2.E 17.78,14.61 17.14,15.24 R2.1
N$29
  Bottom 0.406: R1.1 T1.E
N$31  (via drill 0.6 pad 3.81)
  other vias: 2.54,17.78
N$32  (via drill 0.6 pad 3.81)
  other vias: 83.82,17.78
N$33  (via drill 0.6 pad 3.81)
  other vias: 83.82,-12.7
N$34  (via drill 0.6 pad 3.81)
  other vias: 2.54,-12.7
N$35  (via drill 0.6 pad 1.78)
  other vias: 6.35,17.78
N$36  (via drill 0.6 pad 1.78)
  other vias: 6.35,12.7
N$37  (via drill 0.6 pad 1.78)
  other vias: 6.35,7.62
N$38  (via drill 0.6 pad 1.78)
  other vias: 6.35,2.54
N$39  (via drill 0.6 pad 1.78)
  other vias: 6.35,-2.54
N$40  (via drill 0.6 pad 1.78)
  other vias: 6.35,-7.62
N$41  (via drill 0.6 pad 1.78)
  other vias: 6.35,-12.7
N$42  (via drill 0.6 pad 1.78)
  other vias: 8.89,-12.7
N$43  (via drill 0.6 pad 1.78)
  other vias: 13.97,-12.7
N$44  (via drill 0.6 pad 1.78)
  other vias: 19.05,-12.7
N$45  (via drill 0.6 pad 1.78)
  other vias: 24.13,-12.7
N$46  (via drill 0.6 pad 1.78)
  other vias: 29.21,-12.7
N$47  (via drill 0.6 pad 1.78)
  other vias: 34.29,-12.7
N$48  (via drill 0.6 pad 1.78)
  other vias: 39.37,-12.7
N$49  (via drill 0.6 pad 1.78)
  other vias: 44.45,-12.7
N$50  (via drill 0.6 pad 1.78)
  other vias: 49.53,-12.7
N$51  (via drill 0.6 pad 1.78)
  other vias: 54.61,-12.7
N$52  (via drill 0.6 pad 1.78)
  other vias: 59.69,-12.7
N$53  (via drill 0.6 pad 1.78)
  other vias: 64.77,-12.7
N$54  (via drill 0.6 pad 1.78)
  other vias: 69.85,-12.7
N$55  (via drill 0.6 pad 1.78)
  other vias: 74.93,-12.7
N$56  (via drill 0.6 pad 1.78)
  other vias: 80.01,-12.7
ROW_0
  Bottom 0.406: IC1.19 59.69,18.41 59.05,19.05 22.86,19.05 21.59,17.78 T1.B
ROW_1
  Bottom 0.406: T2.B 22.86,17.46 23.5,18.1 48.9,18.1 49.53,17.46 IC1.23
ROW_2
  Bottom 0.406: IC1.25 44.45,14.61 43.81,15.24 29.84,15.24 29.21,14.61 29.21,9.53 28.57,8.89 22.86,8.89 T3.B
ROW_3
  Bottom 0.406: IC1.27 39.37,12.06 38.73,12.7 32.38,12.7 31.75,12.06 31.75,3.17 31.11,2.54 T4.B
ROW_4
  Bottom 0.406: IC1.28 33.66,10.16 33.02,9.53 33.02,0.64 32.38,0 T5.B
ROW_5
  Bottom 0.406: IC1.24 46.99,15.88 46.35,16.51 T6.B
ROW_6
  Bottom 0.406: IC1.26 41.91,13.34 41.27,13.97 31.11,13.97 30.48,13.34 30.48,5.71 29.84,5.08 T7.B